# Altium schematic sheet CDCDCDC_3V.SchDoc
size A4
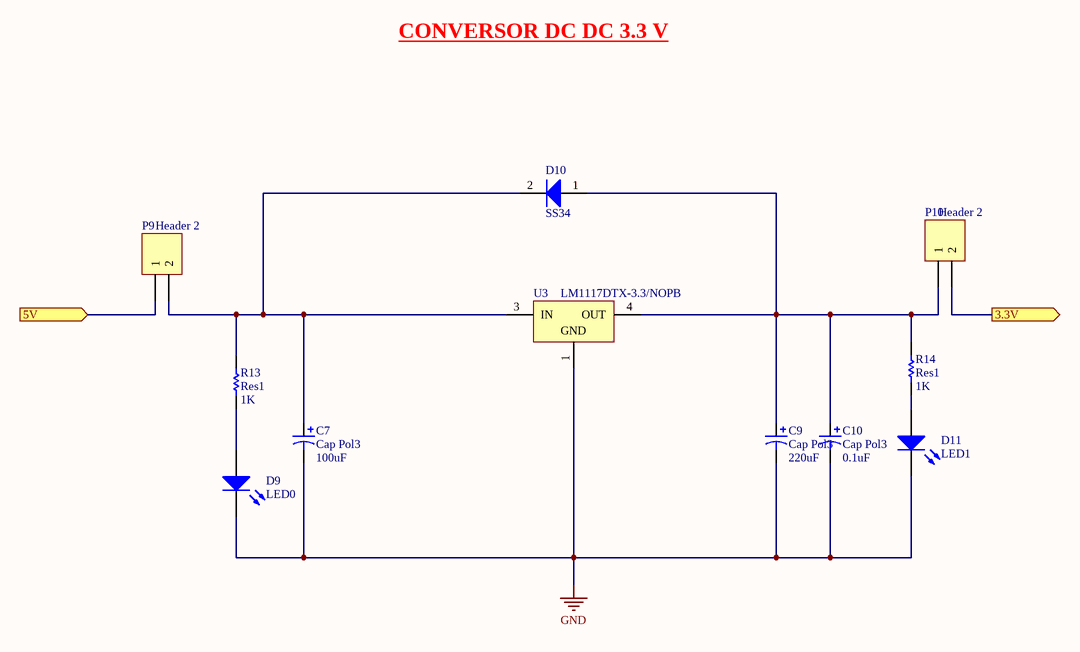
[diagram p0: CDCDCDC_3V.SchDoc]

## Parts
C7  Cap Pol3  value 100uF  [1812]
C9  Cap Pol3  value 220uF  [1812]
C10  Cap Pol3  value 0.1uF  [1812]
D9  LED0  [LED-0]
D10  SS34  [SMC]
D11  LED1  [LED-0]
P9  Header 2  [HDR1X2]
P10  Header 2  [HDR1X2]
R13  Res1  value 1K  [AXIAL-0.3]
R14  Res1  value 1K  [AXIAL-0.3]
U3  LM1117DTX-3.3/NOPB  [NDP0003B_L]

## Ports
3.3V (out), 5V (in)

## Nets
GND: C7.2 C9.2 C10.2 D9.2(K) D11.2(K) U3.1(GND)
3.3V: P10.2 ; port 3.3V
5V: P9.1 ; port 5V
NetC7_1: C7.1 D10.2(K) P9.2 R13.2 U3.3(IN)
NetC9_1: C9.1 C10.1 D10.1(A) P10.1 R14.2 U3.4(OUT)
NetD9_1: D9.1(A) R13.1
NetD11_1: D11.1(A) R14.1

## Notes on the sheet
- CONVERSOR DC DC 3.3 V

## Library data of the parts
C7 C9 C10 = Cap Pol3: Polarized Capacitor (Surface Mount); Published: 8-Jun-2000; LatestRevisionDate: 29-May-2009; LatestRevisionNote: IPC-7351 Footprint Added.; PackageReference: C0805; Publisher: Altium Limited; PackageDescription: Chip Capacitor
D9 D11 = LED0: Typical INFRARED GaAs LED; Published: 8-Jun-2000; LatestRevisionDate: 08-Jul-2005; LatestRevisionNote: Mech Layer 1 removed.; PackageReference: LED-0; Publisher: Altium Limited; PackageDescription: LED; 2 Leads
D10 = Diode: Default Diode; Published: 8-Jun-2000; LatestRevisionDate: 17-Jul-2002; LatestRevisionNote: Re-released for DXP Platform.; PackageVersion: Sep-1996; PackageReference: SMC; Publisher: Altium Limited; PackageDescription: DO-214-AB/SMC; 2 C-Bend Leads; Body 7.9 x 5.9 mm, inc. leads (LxW); Code_JEDEC: DO-214-AB
P9 P10 = Header 2: Header, 2-Pin; LatestRevisionDate: 17-Jul-2002; LatestRevisionNote: Re-released for DXP Platform.; Publisher: Altium Limited
R13 R14 = Res1: Resistor; Published: 8-Jun-2000; LatestRevisionDate: 17-Jul-2002; LatestRevisionNote: Re-released for DXP Platform.; PackageReference: AXIAL-0.3; Publisher: Altium Limited; PackageDescription: Axial Device, Thru-Hole; 2 Leads; 0.3 in Pin Spacing
U3 = CMP-0062-00704-3: 800mA Low-Dropout Linear Regulator, 3-pin TO-252, Pb-Free; Manufacturer: Texas Instruments; CompType: LDO IC; PowerWise: N; PackageTopMarking: NSUZXYTT*LM1117*DT-3.3; ComponentLink1URL: http://www.ti.com/general/docs/lit/getliterature.tsp?genericPartNumber=LM1117-N&fileType=pdf; Code_JEDEC: TO-252-AA; ComponentLink1Description: Datasheet URL; PackageDescription: TO252, Molded, Jedec, 6.8 x 6.10 x 2.30mm Body, 3 Lead, 2.28mm Pitch, Surface Mount; PinCount: 3; RoHS: Y; PackageReference: NDP0003B